# Altium project Contador_Geiger.PrjPcb
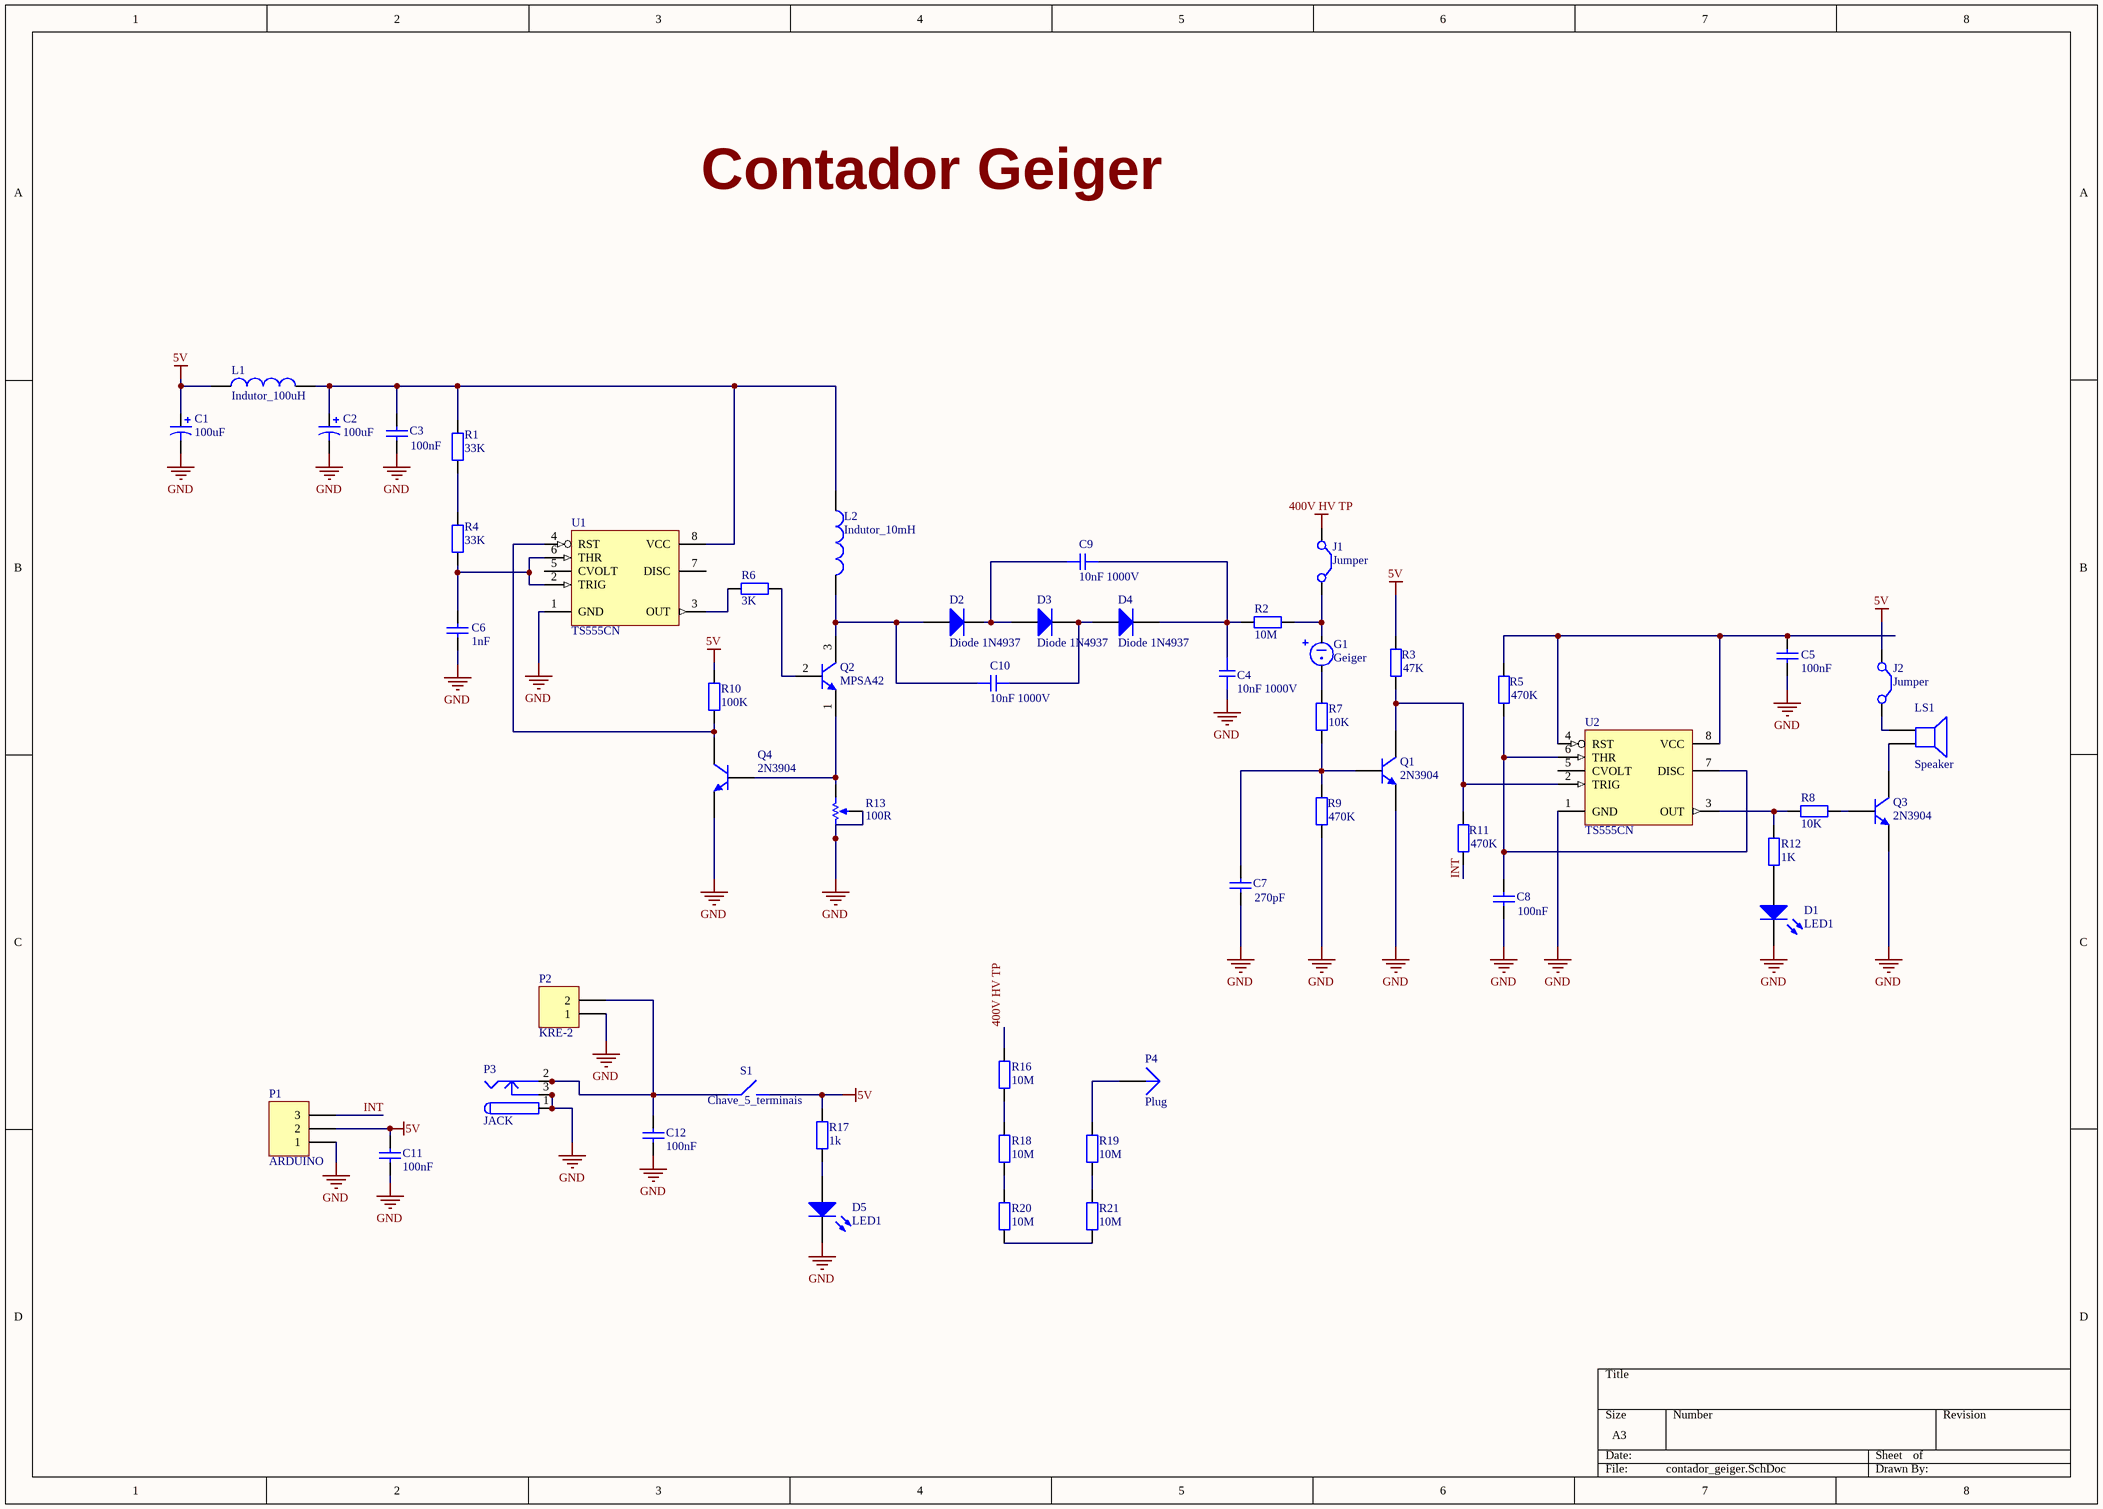
[diagram p0: contador_geiger.SchDoc]
1 sheet, 53 parts. Net scope: global (net labels, ports and power ports of the same name join across sheets).
Board file: contador_geiger.PcbDoc

## Sheet contador_geiger.SchDoc
size A3

### Parts
C1  value 100uF  [RB7.6-15]  (hidden comment: Cap Pol1)
C2  value 100uF  [RB7.6-15]  (hidden comment: Cap Pol1)
C3  value 100nF  [RAD-0.3]  (hidden comment: Cap)
C4  10nF 1000V  [Cap_10nF_1000V]
C5  value 100nF  [RAD-0.3]  (hidden comment: Cap)
C6  value 1nF  [RAD-0.3]  (hidden comment: Cap)
C7  value 270pF  [RAD-0.3]  (hidden comment: Cap)
C8  value 100nF  [RAD-0.3]  (hidden comment: Cap)
C9  10nF 1000V  [Cap_10nF_1000V]
C10  10nF 1000V  [Cap_10nF_1000V]
C11  value 100nF  [RAD-0.3]  (hidden comment: Cap)
C12  value 100nF  [RAD-0.3]  (hidden comment: Cap)
D1  LED1  [LED-0]
D2  Diode 1N4937  [DO-41]
D3  Diode 1N4937  [DO-41]
D4  Diode 1N4937  [DO-41]
D5  LED1  [LED-0]
G1  Geiger  [Tubo Geiger]
J1  Jumper  [RAD-0.2]
J2  Jumper  [RAD-0.2]
L1  Indutor_100uH  [Indutor_100uH]
L2  Indutor_10mH  [Indutor_10mH]
LS1  Speaker  [PIN2]
P1  ARDUINO  [HDR1X3]
P2  KRE-2  [HDR1X2]
P3  JACK  [KLD-0202]
P4  Plug  [PIN1]
Q1  2N3904  [TO-92A]
Q2  MPSA42  [ONSC-TO-92-3-29-11]
Q3  2N3904  [TO-92A]
Q4  2N3904  [TO-92A]
R1  value 33K  [AXIAL-0.4]  (hidden comment: Res2)
R2  value 10M  [AXIAL-0.4]  (hidden comment: Res2)
R3  value 47K  [AXIAL-0.4]  (hidden comment: Res2)
R4  value 33K  [AXIAL-0.4]  (hidden comment: Res2)
R5  value 470K  [AXIAL-0.4]  (hidden comment: Res2)
R6  value 3K  [AXIAL-0.4]  (hidden comment: Res2)
R7  value 10K  [AXIAL-0.4]  (hidden comment: Res2)
R8  value 10K  [AXIAL-0.4]  (hidden comment: Res2)
R9  value 470K  [AXIAL-0.4]  (hidden comment: Res2)
R10  value 100K  [AXIAL-0.4]  (hidden comment: Res2)
R11  value 470K  [AXIAL-0.4]  (hidden comment: Res2)
R12  value 1K  [AXIAL-0.4]  (hidden comment: Res2)
R13  value 100R  [VR5]  (hidden comment: RPot)
R16  value 10M  [AXIAL-0.4]  (hidden comment: Res2)
R17  value 1k  [AXIAL-0.4]  (hidden comment: Res2)
R18  value 10M  [AXIAL-0.4]  (hidden comment: Res2)
R19  value 10M  [AXIAL-0.4]  (hidden comment: Res2)
R20  value 10M  [AXIAL-0.4]  (hidden comment: Res2)
R21  value 10M  [AXIAL-0.4]  (hidden comment: Res2)
S1  Chave_5_terminais  [Chave_5_terminais]
U1  TS555CN  [DIP8]
U2  TS555CN  [DIP8]

### Nets
5V: C1.1 C11.1 J2.1(C1) L1.1 P1.2 R3.2 R10.2 R17.2 S1.2
400V HV TP: J1.1(C1) R16.2
GND: C1.2 C2.2 C3.1 C4.1 C5.1 C6.1 C7.1 C8.1 C11.2 C12.2 D1.2(K) D5.2(K) P1.1 P2.1 P3.1 P3.1A P3.1B P3.3 P3.3A P3.3B Q1.1(E) Q3.1(E) Q4.1(E) R9.1 R13.2(BOT) R13.3(TAP) U1.1(GND) U2.1(GND)
INT: P1.3 R11.1
NetC2_1: C2.1 C3.2 L1.2 L2.1 R1.2 U1.8(VCC)
NetC4_2: C4.2 C9.2 D4.2(K) R2.2
NetC5_2: C5.2 R5.2 U2.4(RST) U2.8(VCC)
NetC6_2: C6.2 R4.1 U1.2(TRIG) U1.6(THR)
NetC7_2: C7.2 Q1.2(B) R7.1 R9.2
NetC8_2: C8.2 R5.1 U2.6(THR) U2.7(DISC)
NetC9_1: C9.1 D2.2(K) D3.1(A)
NetC10_1: C10.1 D2.1(A) L2.2 Q2.3(C)
NetC10_2: C10.2 D3.2(K) D4.1(A)
NetC12_1: C12.1 P2.2 P3.2 P3.2A P3.2B S1.1
NetD1_1: D1.1(A) R12.1
NetD5_1: D5.1(A) R17.1
NetG1_1: G1.1 J1.2(C2) R2.1
NetG1_2: G1.2 R7.2
NetJ2_2: J2.2(C2) LS1.1
NetLS1_2: LS1.2 Q3.3(C)
NetP4_1: P4.1 R19.2
NetQ1_3: Q1.3(C) R3.1 R11.2 U2.2(TRIG)
NetQ2_1: Q2.1(E) Q4.2(B) R13.1(TOP)
NetQ2_2: Q2.2(B) R6.1
NetQ3_2: Q3.2(B) R8.2
NetQ4_3: Q4.3(C) R10.1 U1.4(RST)
NetR1_1: R1.1 R4.2
NetR6_2: R6.2 U1.3(OUT)
NetR8_1: R8.1 R12.2 U2.3(OUT)
NetR16_1: R16.1 R18.2
NetR18_1: R18.1 R20.2
NetR19_1: R19.1 R21.2
NetR20_1: R20.1 R21.1

Not connected (* = marked no-connect by the designer): U1 5(CVOLT) 7(DISC); U2 5(CVOLT)

### Notes on the sheet
- Contador Geiger

### Library data of the parts
C1 C2 = Cap Pol1: Polarized Capacitor (Radial); Published: 8-Jun-2000; LatestRevisionDate: 17-Jul-2002; LatestRevisionNote: Re-released for DXP Platform.; PackageReference: RB7.6-15; Publisher: Altium Limited; PackageDescription: Polarized Capacitor (Radial); 2 Leads
C3 C5-C8 C11 C12 = Cap: Capacitor; Published: 8-Jun-2000; LatestRevisionDate: 17-Jul-2002; LatestRevisionNote: Re-released for DXP Platform.; PackageReference: RAD-0.3; Publisher: Altium Limited; PackageDescription: Radial Cap, Thru-Hole; 2 Leads; 0.3 in Pin Spacing
C4 C9 C10 = Capacitor_10n/1000V
D1 D5 = LED0: Typical INFRARED GaAs LED; Published: 8-Jun-2000; LatestRevisionDate: 08-Jul-2005; LatestRevisionNote: Mech Layer 1 removed.; PackageReference: LED-0; Publisher: Altium Limited; PackageDescription: LED; 2 Leads
D2-D4 = Diode 1N4934: 1 Amp Fast Recovery Rectifier; Published: 8-Jun-2000; LatestRevisionDate: 17-Jul-2002; LatestRevisionNote: Re-released for DXP Platform.; DatasheetVersion: 1999; PackageVersion: Aug-1999; PackageReference: DO-41; Publisher: Altium Limited; PackageDescription: Diode, Axial; Body 5.2 x 2.7 mm (LxDia. max), Lead Dia. 0.86 mm (max); Code_JEDEC: DO-204-AL; ComponentLink1Description: Manufacturer Link; ComponentLink1URL: http://www.fairchildsemi.com/; ComponentLink2Description: Datasheet; ComponentLink2URL: http://www.fairchildsemi.com/ds/1N%2F1N4934.pdf
G1 = Tubo_Geiger
J1 J2 = Jumper: Jumper Wire; Published: 24-Mar-1999; LatestRevisionDate: 17-Jul-2002; LatestRevisionNote: Re-released for DXP Platform.; PackageReference: RAD-0.2; Publisher: Altium Limited; PackageDescription: Radial Cap, Thru-Hole; 2 Leads; 0.2 in Pin Spacing
LS1 = Speaker: Loudspeaker; Published: 24-Mar-1999; LatestRevisionDate: 17-Jul-2002; LatestRevisionNote: Re-released for DXP Platform.; PackageReference: PIN2; Publisher: Altium Limited
P1 = Header 3: Header, 3-Pin; LatestRevisionDate: 17-Jul-2002; LatestRevisionNote: Re-released for DXP Platform.; Publisher: Altium Limited
P2 = Header 2: Header, 2-Pin; LatestRevisionDate: 17-Jul-2002; LatestRevisionNote: Re-released for DXP Platform.; Publisher: Altium Limited
P3 = PWR2.5: Low Voltage Power Supply Connector; Published: 17-Dec-2003; DatasheetDocument: 09-May-2002; Publisher: Altium Limited; ComponentLink1Description: Manufacturer Link; ComponentLink1URL: http://domino.kycon.com/internet/Products.html
Q1 Q3 Q4 = 2N3904: NPN General Purpose Amplifier; Published: 8-Jun-2000; LatestRevisionDate: 15-Jan-2003; LatestRevisionNote: PCB Footprint 'BCY-W3/D4.7' replaced; DatasheetVersion: 1997; PackageVersion: Sep-1998; PackageReference: TO-92A; Publisher: Altium Limited; PackageDescription: TO, Flat Index; 3 In-Line, Axial Leads; Body Dia. 4.5mm; Leads 0.51 x 0.48 mm (max); ComponentLink1Description: Manufacturer Link; ComponentLink1URL: http://www.fairchildsemi.com/; ComponentLink2Description: Datasheet; ComponentLink2URL: http://www.fairchildsemi.com/ds/2N%2F2N3904.pdf
Q2 = MPSA42: High Voltage Transistor, NPN Silicon, 3-Pin TO-92, Bulk Box; Manufacturer: On Semiconductor; Note: 0; fT Min (MHz): 50; IC Continuous (A): 0.5; DatasheetVersion: Rev. 8; PackageVersion: Rev. AM; PackageReference: TO-92-3-29-11_AM_SL; PackageDescription: 3-Pin Transistor Outline, Body 4.825 x 3.685 mm, Pitch 1.27 mm; Packing: Bulk Box; Polarity: NPN; RoHS: FALSE; Mounting Technology: Through Hole; PartNumber: MPSA42; ComponentLink1Description: Manufacturer URL; ComponentLink1URL: http://www.onsemi.com/; ComponentLink2Description: Datasheet; ComponentLink2URL: http://www.onsemi.cn/pub_link/Collateral/MPSA42-D.PDF; ComponentLink3Description: Package Specification; ComponentLink3URL: http://www.onsemi.cn/pub_link/Collateral/2N6426-D.PDF
R1-R12 R16-R21 = Res2: Resistor; Published: 8-Jun-2000; LatestRevisionDate: 17-Jul-2002; LatestRevisionNote: Re-released for DXP Platform.; PackageReference: AXIAL-0.4; Publisher: Altium Limited; PackageDescription: Axial Device, Thru-Hole; 2 Leads; 0.4 in Pin Spacing
R13 = RPot: Potentiometer; Sim Note: Enter the Resistance value and the set point into parameter fields.; Set Position: 0.5; Published: 8-Jun-2000; LatestRevisionDate: 17-Jul-2002; LatestRevisionNote: Re-released for DXP Platform.; PackageReference: VR5; Publisher: Altium Limited; PackageDescription: Variable Resistor, Thru-Hole; 3 Leads
U1 U2 = TS555CN: Low-Power Single CMOS Timer; Published: 24-Aug-2001; LatestRevisionDate: 06-Jun-2005; LatestRevisionNote: Stylized 3D Model Added.; DatasheetVersion: Jan-1999; PackageReference: DIP8; Publisher: Altium Limited; PackageDescription: DIP; 8 Leads; Row Spacing 7.62 mm; Pitch 2.54 mm; Code_JEDEC: MO-001-AN; ComponentLink1Description: Manufacturer Link; ComponentLink1URL: http://www.st.com/; ComponentLink2Description: Datasheet; ComponentLink2URL: http://www.st.com/stonline/products/literature/ds/4077/ts555.pdf
P4 = Plug: LatestRevisionDate: 17-Jul-2002; LatestRevisionNote: Re-released for DXP Platform.; Publisher: Altium Limited